# EAGLE design motor_front (EAGLE 7.7.0)
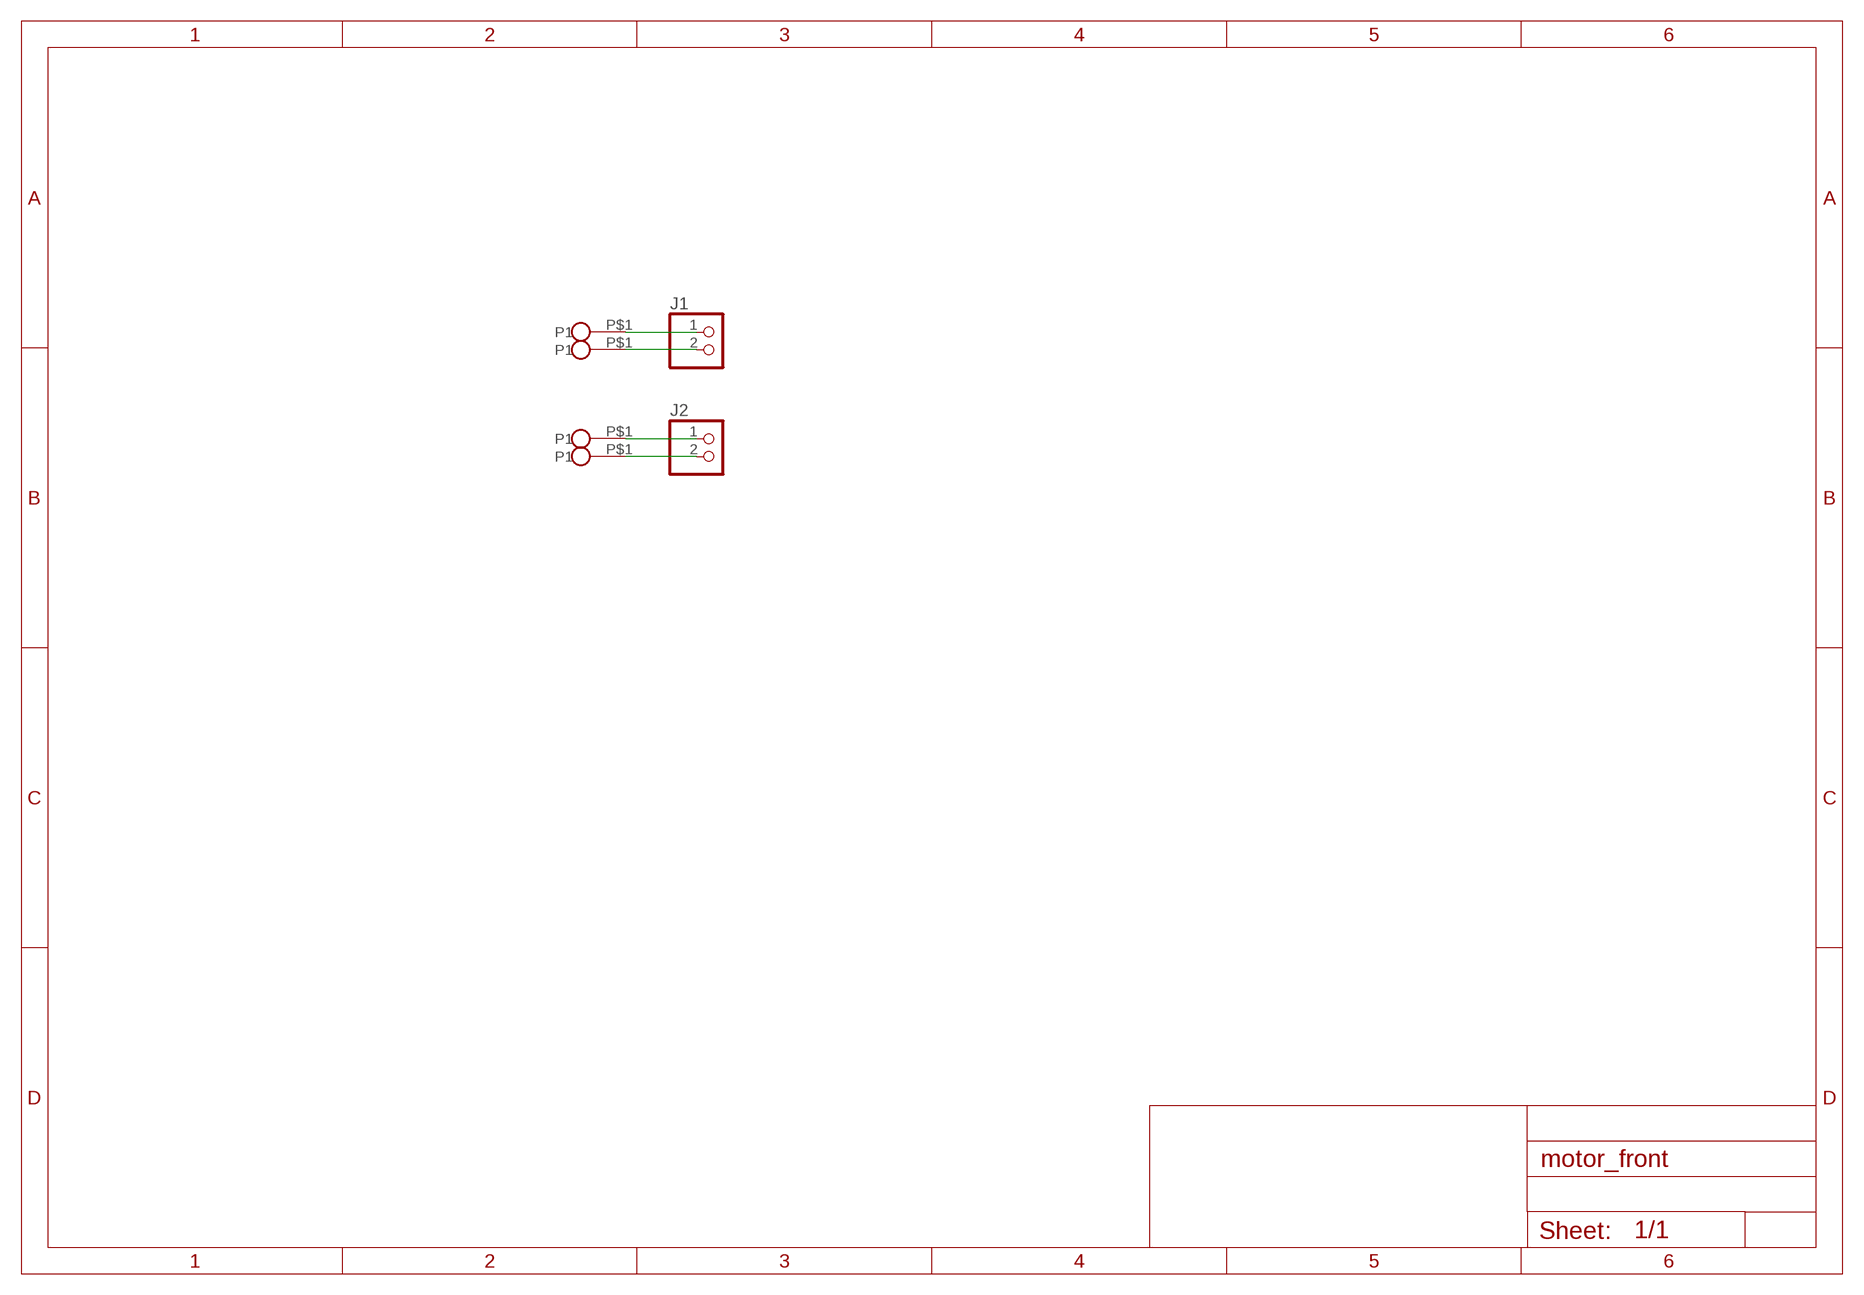
[diagram p0: schematic, sheet 1]

## Parts
J1  PINHD-1X2  [1X02]
J2  PINHD-1X2  [1X02]
U$1  BIGHOLE  [BIGHOLE]
U$2  BIGHOLE  [BIGHOLE]
U$3  BIGHOLE  [BIGHOLE]
U$4  BIGHOLE  [BIGHOLE]

## Nets
N$1: J1.1 U$1.P$1(P1)
N$2: J1.2 U$2.P$1(P1)
N$3: J2.1 U$4.P$1(P1)
N$4: J2.2 U$3.P$1(P1)

## Library data of the parts
J1 J2 = pinhead:PINHD-1X2: PIN HEADER
U$1-U$4 = testpoint:BIGHOLE

## Board
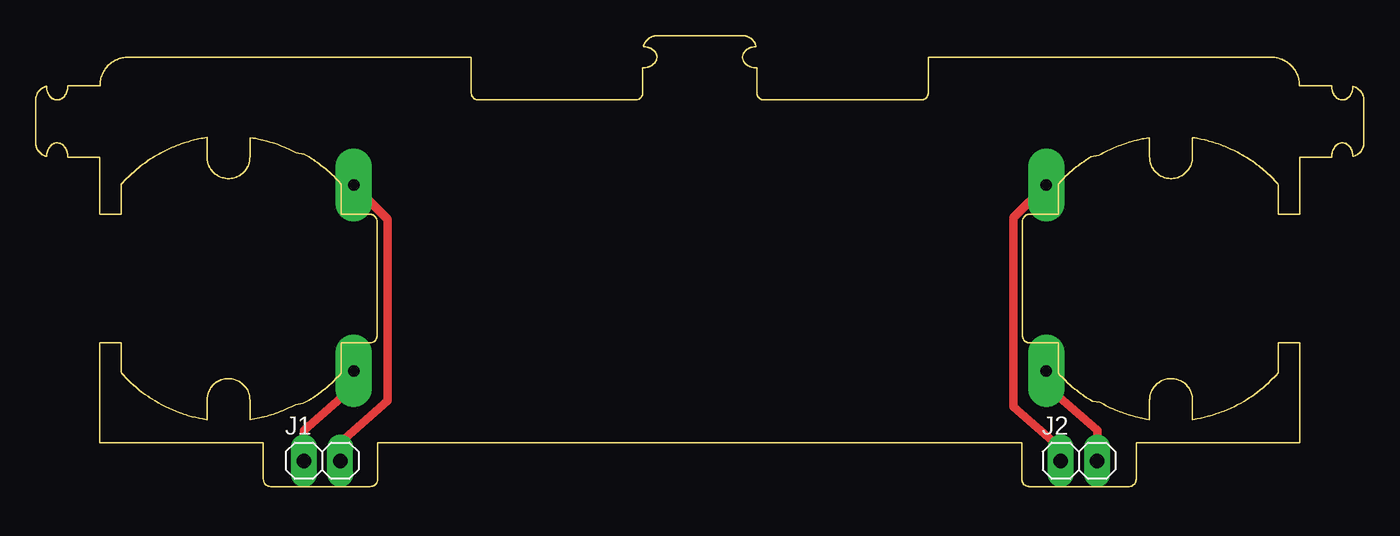
[diagram p1: board, top side]

Size 93 x 31.56 mm. Coordinates in mm from the lower left corner, seen from the top.
Outline: 43.5,31.56 43.45,31.55 43.39,31.55 43.34,31.54 43.29,31.53 43.24,31.52 43.19,31.5 43.14,31.49 43.09,31.47 43.04,31.44 43,31.41 42.95,31.39 42.91,31.36 42.87,31.32 42.83,31.29 42.79,31.25 42.76,31.21 42.73,31.17 42.69,31.12 42.67,31.08 42.64,31.03 42.62,30.99 42.6,30.94 42.58,30.89 42.56,30.84 42.56,30.8 42.67,30.79 42.72,30.78 42.82,30.76 42.87,30.75 42.92,30.73 42.97,30.71 43.02,30.69 43.07,30.67 43.12,30.64 43.16,30.61 43.21,30.58 43.25,30.55 43.29,30.52 43.32,30.48 43.36,30.44 43.39,30.4 43.42,30.35 43.44,30.3 43.46,30.26 43.48,30.21 43.49,30.15 43.5,30.1 43.5,30.05 43.5,30 43.49,29.94 43.48,29.89 43.46,29.84 43.44,29.79 43.41,29.75 43.38,29.7 43.35,29.66 43.32,29.62 43.28,29.59 43.24,29.55 43.2,29.52 43.15,29.49 43.11,29.46 43.06,29.43 43.01,29.41 42.97,29.39 42.92,29.37 42.87,29.36 42.81,29.34 42.71,29.32 42.61,29.31 42.5,29.31 42.5,27.56 42.5,27.51 42.49,27.45 42.48,27.4 42.46,27.35 42.43,27.31 42.41,27.26 42.37,27.22 42.33,27.18 42.29,27.15 42.25,27.12 42.2,27.1 42.15,27.08 42.1,27.07 42.05,27.06 42,27.06 31.04,27.06 30.99,27.06 30.94,27.06 30.88,27.07 30.83,27.09 30.78,27.11 30.74,27.13 30.69,27.16 30.65,27.19 30.62,27.23 30.59,27.27 30.56,27.32 30.54,27.37 30.52,27.42 30.51,27.47 30.5,27.52 30.5,27.57 30.5,30.01 30.49,30.06 6.52,30.06 6.42,30.05 6.36,30.05 6.26,30.04 6.15,30.03 6.05,30.01 6,29.99 5.9,29.96 5.8,29.93 5.7,29.89 5.65,29.87 5.56,29.82 5.46,29.77 5.42,29.74 5.33,29.68 5.25,29.62 5.21,29.58 5.13,29.51 5.05,29.44 4.98,29.36 4.91,29.28 4.88,29.24 4.82,29.15 4.77,29.06 4.72,28.97 4.69,28.92 4.65,28.82 4.61,28.72 4.6,28.67 4.57,28.57 4.54,28.47 4.52,28.36 4.52,28.31 4.51,28.21 4.5,28.1 4.49,28.06 2.27,28.06 2.25,28.02 2.24,27.92 2.23,27.81 2.22,27.76 2.2,27.71 2.19,27.66 2.17,27.61 2.15,27.56 2.13,27.51 2.11,27.46 2.08,27.42 2.05,27.37 2.02,27.33 1.98,27.29 1.95,27.25 1.91,27.22 1.87,27.18 1.82,27.15 1.78,27.13 1.73,27.1 1.68,27.09 1.63,27.07 1.58,27.06 1.53,27.06 1.47,27.06 1.42,27.06 1.37,27.07 1.32,27.09 1.27,27.11 1.22,27.13 1.17,27.16 1.13,27.19 1.09,27.22 1.05,27.26 1.02,27.3 0.98,27.34 0.95,27.38 0.92,27.42 0.9,27.47 0.87,27.52 0.85,27.57 0.83,27.61 0.82,27.66 0.8,27.71 0.79,27.77 0.77,27.87 0.76,27.98 0.74,28 0.69,27.99 0.64,27.97 0.59,27.95 0.54,27.93 0.49,27.9 0.45,27.87 0.4,27.84 0.36,27.81 0.32,27.78 0.28,27.74 0.25,27.7 0.21,27.66 0.18,27.62 0.15,27.57 0.12,27.53 0.1,27.48 0.08,27.43 0.06,27.39 0.04,27.34 0.03,27.28 0.02,27.23 0.01,27.18 0,27.13 0,27.02 0,24.06 0,24.01 0.01,23.95 0.01,23.9 0.02,23.85 0.03,23.8 0.05,23.75 0.07,23.7 0.09,23.65 0.11,23.6 0.14,23.55 0.17,23.51 0.2,23.47 0.23,23.43 0.27,23.39 0.31,23.35 0.35,23.32 0.39,23.28 0.43,23.25 0.47,23.22 0.52,23.2 0.57,23.17 0.62,23.15 0.67,23.13 0.72,23.12 0.76,23.12 0.77,23.22 0.78,23.33 0.8,23.38 0.81,23.43 0.83,23.48 0.84,23.53 0.86,23.58 0.89,23.62 0.91,23.67 0.94,23.72 0.97,23.76 1,23.8 1.04,23.84 1.08,23.88 1.12,23.91 1.16,23.95 1.2,23.97 1.25,24 1.3,24.02 1.35,24.04 1.4,24.05 1.45,24.05 1.5,24.06 1.56,24.05 1.61,24.05 1.66,24.03 1.71,24.02 1.76,24 1.81,23.97 1.85,23.94 1.89,23.91 1.93,23.87 1.97,23.84 2.01,23.8 2.04,23.75 2.07,23.71 2.1,23.67 2.12,23.62 2.14,23.57 2.16,23.52 2.18,23.47 2.2,23.42 2.21,23.37 2.23,23.27 2.25,23.16 2.25,23.06 2.3,23.06 4.47,23.06 4.5,23.03 4.5,19.06 4.55,19.06 5.97,19.06 6,19.08 6,21.15 6.02,21.19 6.13,21.31 6.24,21.42 6.35,21.54 6.5,21.69 6.61,21.8 6.73,21.91 6.85,22.01 6.97,22.12 7.09,22.22 7.21,22.32 7.33,22.42 7.5,22.55 7.63,22.64 7.76,22.74 7.89,22.83 8.07,22.94 8.2,23.03 8.34,23.11 8.47,23.19 8.61,23.27 8.8,23.37 8.94,23.45 9.13,23.54 9.27,23.61 9.41,23.68 9.56,23.74 9.7,23.8 9.9,23.88 10.05,23.93 10.2,23.99 10.4,24.06 10.55,24.1 10.7,24.15 10.86,24.19 11.11,24.26 11.27,24.3 11.42,24.33 11.58,24.36 11.73,24.39 11.99,24.43 12,24.39 12,23.01 12,22.96 12.01,22.86 12.03,22.75 12.06,22.65 12.09,22.55 12.13,22.45 12.17,22.35 12.23,22.26 12.25,22.22 12.32,22.13 12.39,22.05 12.42,22.01 12.5,21.94 12.58,21.87 12.66,21.81 12.71,21.78 12.8,21.73 12.9,21.68 12.95,21.66 13.04,21.63 13.15,21.6 13.25,21.58 13.3,21.57 13.41,21.56 13.46,21.56 13.57,21.56 13.67,21.57 13.78,21.58 13.83,21.59 13.93,21.62 14.03,21.65 14.08,21.67 14.18,21.72 14.27,21.77 14.31,21.8 14.4,21.86 14.44,21.89 14.52,21.96 14.56,21.99 14.6,22.03 14.67,22.11 14.73,22.2 14.76,22.24 14.79,22.29 14.84,22.38 14.86,22.43 14.9,22.52 14.94,22.62 14.95,22.68 14.97,22.78 14.99,22.88 15,22.99 15,23.09 15,24.42 15.03,24.43 15.24,24.4 15.4,24.37 15.61,24.32 15.76,24.29 15.92,24.25 16.07,24.21 16.22,24.17 16.42,24.11 16.58,24.06 16.73,24.01 16.93,23.94 17.08,23.89 17.22,23.83 17.42,23.75 17.56,23.68 17.76,23.6 17.9,23.53 18.09,23.43 18.23,23.36 18.81,23.26 19,23.15 19.13,23.07 19.31,22.96 19.45,22.87 19.58,22.78 19.71,22.69 19.84,22.6 20,22.47 20.17,22.34 20.29,22.24 20.41,22.13 20.57,22 20.77,21.82 20.88,21.71 21,21.59 21.11,21.48 21.22,21.36 21.39,21.17 21.4,21.12 21.4,19.11 21.4,19.06 23.36,19.06 23.41,19.06 23.46,19.05 23.52,19.04 23.57,19.03 23.62,19.01 23.66,18.98 23.71,18.95 23.75,18.92 23.78,18.88 23.81,18.84 23.84,18.79 23.86,18.74 23.88,18.69 23.89,18.64 23.9,18.59 23.9,18.54 23.9,10.55 23.9,10.49 23.89,10.44 23.87,10.39 23.85,10.34 23.83,10.29 23.8,10.25 23.76,10.21 23.72,10.18 23.68,10.14 23.64,10.12 23.59,10.09 23.54,10.08 23.49,10.06 23.43,10.06 23.38,10.06 21.42,10.06 21.4,10.03 21.4,7.96 21.37,7.92 21.23,7.76 21.05,7.57 20.86,7.39 20.71,7.24 20.55,7.1 20.39,6.96 20.23,6.82 20.06,6.69 19.94,6.59 19.81,6.5 19.68,6.41 19.55,6.32 19.42,6.23 19.29,6.14 19.15,6.05 19.02,5.97 18.88,5.89 18.74,5.82 18.2,5.74 18.06,5.67 17.92,5.59 17.73,5.5 17.59,5.44 17.44,5.37 17.29,5.31 17.15,5.25 16.95,5.18 16.8,5.12 16.65,5.07 16.5,5.02 16.35,4.98 16.19,4.93 15.99,4.88 15.83,4.84 15.68,4.8 15.52,4.77 15.32,4.73 15.16,4.7 15,4.68 15,4.73 15,6.05 15,6.15 14.99,6.26 14.97,6.36 14.94,6.47 14.91,6.57 14.89,6.62 14.87,6.67 14.83,6.76 14.77,6.85 14.74,6.9 14.68,6.98 14.61,7.06 14.54,7.14 14.5,7.17 14.42,7.24 14.33,7.3 14.24,7.36 14.15,7.41 14.05,7.45 13.95,7.49 13.85,7.51 13.75,7.54 13.64,7.55 13.59,7.55 13.48,7.56 13.38,7.55 13.33,7.55 13.22,7.53 13.12,7.51 13.02,7.48 12.97,7.46 12.87,7.42 12.82,7.39 12.73,7.34 12.68,7.32 12.6,7.26 12.51,7.19 12.48,7.15 12.4,7.08 12.33,7 12.27,6.91 12.21,6.83 12.18,6.78 12.14,6.68 12.12,6.64 12.08,6.54 12.06,6.49 12.04,6.38 12.03,6.33 12.01,6.23 12,6.12 12,6.02 12,4.69 11.96,4.68 11.7,4.73 11.44,4.78 11.19,4.83 10.93,4.9 10.67,4.97 10.52,5.02 10.37,5.07 10.22,5.12 10.07,5.17 9.82,5.26 9.58,5.36 9.34,5.47 9.1,5.58 8.96,5.66 8.82,5.73 8.58,5.86 8.36,5.99 8.13,6.13 8,6.21 7.87,6.3 7.65,6.46 7.44,6.61 7.23,6.78 7.02,6.95 6.82,7.12 6.67,7.26 6.52,7.41 6.33,7.59 6.15,7.79 6.01,7.95 6,8 6,10.01 6,10.06 4.52,10.06 4.5,10.02 4.5,3.09 4.52,3.06 15.9,3.06 15.94,3.05 15.94,0.51 15.95,0.46 15.95,0.4 15.97,0.35 15.98,0.3 16.01,0.25 16.04,0.21 16.07,0.17 16.11,0.13 16.15,0.1 16.19,0.07 16.24,0.04 16.29,0.03 16.34,0.01 16.39,0 16.44,0 23.43,0 23.48,0 23.53,0.01 23.59,0.02 23.64,0.04 23.68,0.06 23.73,0.09 23.77,0.12 23.81,0.16 23.84,0.2 23.87,0.24 23.9,0.29 23.92,0.34 23.93,0.39 23.94,0.44 23.94,0.49 23.94,3.04 23.97,3.06 69.06,3.06 69.06,0.52 69.06,0.46 69.07,0.41 69.08,0.36 69.1,0.31 69.12,0.26 69.15,0.22 69.18,0.17 69.21,0.14 69.25,0.1 69.3,0.07 69.34,0.05 69.39,0.03 69.44,0.01 69.5,0 69.55,0 76.53,0 76.59,0 76.64,0.01 76.69,0.02 76.74,0.04 76.79,0.06 76.83,0.08 76.88,0.12 76.92,0.15 76.95,0.19 76.98,0.23 77.01,0.28 77.03,0.33 77.04,0.38 77.05,0.43 77.06,0.49 77.06,0.54 77.06,3.03 77.08,3.06 88.46,3.06 88.5,3.06 88.5,10.05 88.45,10.06 87.02,10.06 87,10.03 87,7.96 86.97,7.92 86.87,7.8 86.76,7.69 86.57,7.5 86.46,7.39 86.35,7.28 86.15,7.1 85.95,6.93 85.75,6.76 85.54,6.6 85.32,6.44 85.11,6.29 84.97,6.2 84.84,6.12 84.62,5.98 84.39,5.84 84.15,5.72 83.92,5.6 83.68,5.49 83.44,5.38 83.19,5.28 83.04,5.22 82.9,5.16 82.65,5.08 82.39,5 82.24,4.95 82.09,4.91 81.83,4.85 81.57,4.79 81.31,4.74 81.16,4.71 81,4.68 81,6.06 81,6.17 80.99,6.22 80.98,6.32 80.95,6.43 80.93,6.53 80.89,6.63 80.84,6.72 80.82,6.77 80.77,6.86 80.71,6.95 80.64,7.03 80.57,7.11 80.53,7.15 80.45,7.22 80.37,7.28 80.28,7.34 80.19,7.39 80.14,7.41 80.04,7.46 79.99,7.47 79.89,7.5 79.84,7.52 79.74,7.54 79.63,7.55 79.53,7.56 79.42,7.55 79.37,7.55 79.26,7.54 79.21,7.53 79.11,7.5 79.01,7.47 78.91,7.43 78.81,7.39 78.72,7.34 78.63,7.28 78.55,7.22 78.47,7.15 78.39,7.07 78.32,6.99 78.29,6.95 78.23,6.86 78.18,6.77 78.15,6.72 78.13,6.67 78.09,6.58 78.06,6.48 78.03,6.37 78.02,6.32 78.01,6.22 78,6.11 78,6.06 78,4.74 78,4.68 77.79,4.72 77.63,4.75 77.48,4.78 77.32,4.81 77.17,4.85 77.01,4.88 76.81,4.94 76.66,4.98 76.5,5.03 76.35,5.08 76.2,5.13 76.05,5.18 75.9,5.24 75.76,5.3 75.56,5.38 75.42,5.44 75.22,5.53 75.08,5.6 74.94,5.67 74.8,5.74 74.66,5.82 74.52,5.9 73.98,5.98 73.85,6.06 73.71,6.14 73.58,6.23 73.45,6.32 73.32,6.41 73.19,6.5 73.02,6.63 72.89,6.73 72.77,6.83 72.61,6.96 72.45,7.1 72.25,7.28 72.1,7.42 71.91,7.61 71.73,7.8 71.63,7.92 71.6,7.97 71.6,10.03 71.57,10.06 69.62,10.06 69.56,10.06 69.51,10.06 69.46,10.08 69.41,10.09 69.36,10.12 69.32,10.14 69.27,10.18 69.24,10.21 69.2,10.25 69.17,10.3 69.15,10.34 69.13,10.39 69.11,10.44 69.1,10.5 69.1,10.55 69.1,18.54 69.1,18.59 69.11,18.64 69.12,18.7 69.14,18.75 69.16,18.79 69.19,18.84 69.22,18.88 69.26,18.92 69.3,18.95 69.34,18.98 69.39,19.01 69.43,19.03 69.49,19.04 69.54,19.05 69.59,19.06 71.6,19.06 71.6,21.12 71.61,21.17 71.79,21.37 71.9,21.48 72.01,21.59 72.12,21.71 72.23,21.82 72.43,22 72.55,22.1 72.71,22.24 72.87,22.37 73,22.47 73.13,22.56 73.25,22.66 73.38,22.75 73.56,22.87 73.69,22.95 73.87,23.07 74.45,23.18 74.59,23.25 74.78,23.36 74.92,23.43 75.06,23.5 75.2,23.57 75.34,23.64 75.49,23.7 75.68,23.79 75.83,23.84 75.98,23.9 76.18,23.98 76.38,24.04 76.53,24.09 76.68,24.14 76.89,24.19 77.09,24.25 77.25,24.28 77.45,24.33 77.61,24.36 77.76,24.39 77.97,24.42 78,24.4 78,23.08 78,22.97 78.01,22.87 78.03,22.76 78.05,22.66 78.07,22.61 78.08,22.56 78.12,22.46 78.17,22.37 78.19,22.32 78.25,22.23 78.28,22.18 78.34,22.1 78.41,22.02 78.45,21.98 78.53,21.91 78.57,21.88 78.61,21.85 78.7,21.79 78.79,21.73 78.84,21.71 78.93,21.67 79.03,21.63 79.08,21.61 79.19,21.59 79.29,21.57 79.34,21.57 79.45,21.56 79.55,21.56 79.66,21.57 79.71,21.57 79.82,21.59 79.92,21.61 79.97,21.63 80.07,21.67 80.16,21.71 80.26,21.76 80.35,21.82 80.43,21.88 80.47,21.91 80.55,21.98 80.62,22.06 80.66,22.1 80.72,22.18 80.78,22.27 80.83,22.37 80.88,22.46 80.92,22.56 80.93,22.61 80.96,22.71 80.98,22.82 80.99,22.92 81,23.03 81,24.4 81.03,24.43 81.18,24.4 81.34,24.37 81.6,24.32 81.86,24.26 82.01,24.22 82.16,24.18 82.32,24.14 82.47,24.09 82.62,24.05 82.82,23.98 82.97,23.92 83.12,23.87 83.27,23.81 83.41,23.75 83.56,23.68 83.7,23.62 83.89,23.53 84.04,23.46 84.18,23.39 84.32,23.31 84.46,23.23 84.64,23.13 84.78,23.04 84.95,22.93 85.09,22.84 85.22,22.75 85.39,22.63 85.52,22.54 85.64,22.44 85.77,22.34 85.89,22.24 86.01,22.14 86.13,22.04 86.29,21.89 86.41,21.79 86.52,21.68 86.63,21.56 86.78,21.41 86.89,21.3 86.99,21.18 87,21.13 87,19.06 87.05,19.06 88.48,19.06 88.5,19.08 88.5,23.05 88.55,23.06 90.72,23.06 90.75,23.08 90.76,23.18 90.77,23.29 90.78,23.34 90.79,23.39 90.81,23.44 90.82,23.49 90.84,23.54 90.87,23.59 90.89,23.64 90.92,23.68 90.94,23.73 90.97,23.77 91.01,23.81 91.04,23.85 91.08,23.89 91.12,23.92 91.17,23.95 91.21,23.98 91.26,24 91.31,24.02 91.36,24.04 91.41,24.05 91.46,24.05 91.52,24.06 91.57,24.05 91.62,24.04 91.67,24.03 91.72,24.01 91.77,23.99 91.82,23.96 91.86,23.93 91.9,23.9 91.94,23.86 91.98,23.83 92.01,23.79 92.04,23.74 92.07,23.7 92.1,23.65 92.12,23.61 92.14,23.56 92.16,23.51 92.18,23.46 92.2,23.41 92.21,23.36 92.23,23.25 92.24,23.15 92.25,23.11 92.3,23.12 92.35,23.14 92.4,23.16 92.45,23.18 92.5,23.21 92.54,23.23 92.59,23.26 92.63,23.3 92.67,23.33 92.71,23.36 92.75,23.4 92.78,23.44 92.81,23.48 92.84,23.53 92.87,23.57 92.9,23.62 92.92,23.67 92.94,23.72 92.96,23.77 92.97,23.82 92.98,23.87 92.99,23.92 93,23.97 93,24.03 93,27.04 93,27.09 93,27.15 92.99,27.2 92.98,27.25 92.97,27.3 92.95,27.36 92.94,27.41 92.92,27.45 92.89,27.5 92.87,27.55 92.84,27.59 92.81,27.64 92.77,27.68 92.74,27.72 92.7,27.75 92.66,27.79 92.62,27.82 92.58,27.85 92.54,27.88 92.49,27.91 92.44,27.93 92.39,27.96 92.35,27.98 92.3,27.99 92.24,28.01 92.24,27.9 92.22,27.8 92.21,27.75 92.19,27.7 92.18,27.64 92.16,27.59 92.14,27.55 92.12,27.5 92.09,27.45 92.07,27.41 92.04,27.36 92,27.32 91.97,27.28 91.93,27.24 91.89,27.21 91.85,27.17 91.81,27.14 91.76,27.12 91.71,27.1 91.66,27.08 91.61,27.07 91.56,27.06 91.51,27.06 91.45,27.06 91.4,27.07 91.35,27.08 91.3,27.09 91.25,27.11 91.2,27.14 91.16,27.16 91.12,27.2 91.08,27.23 91.04,27.27 91,27.31 90.97,27.35 90.94,27.39 90.91,27.44 90.89,27.48 90.86,27.53 90.84,27.58 90.82,27.63 90.81,27.68 90.79,27.73 90.77,27.83 90.76,27.94 90.75,28.04 90.71,28.06 88.54,28.06 88.5,28.07 88.5,28.17 88.49,28.28 88.47,28.38 88.46,28.44 88.44,28.54 88.41,28.64 88.38,28.74 88.36,28.79 88.32,28.89 88.27,28.98 88.25,29.03 88.19,29.12 88.14,29.21 88.11,29.25 88.04,29.34 87.97,29.41 87.93,29.45 87.86,29.53 87.78,29.6 87.69,29.66 87.61,29.72 87.52,29.78 87.43,29.83 87.38,29.86 87.28,29.9 87.23,29.92 87.13,29.95 87.03,29.98 86.93,30.01 86.88,30.02 86.77,30.04 86.67,30.05 86.56,30.05 86.46,30.06 62.54,30.06 62.5,30.04 62.5,27.55 62.5,27.5 62.49,27.45 62.47,27.4 62.46,27.35 62.43,27.3 62.4,27.26 62.37,27.22 62.33,27.18 62.29,27.15 62.24,27.12 62.2,27.1 62.15,27.08 62.1,27.07 62.04,27.06 61.99,27.06 50.98,27.06 50.93,27.06 50.88,27.07 50.83,27.09 50.78,27.11 50.73,27.13 50.69,27.16 50.65,27.2 50.62,27.24 50.58,27.28 50.56,27.32 50.53,27.37 50.52,27.42 50.51,27.47 50.5,27.53 50.5,27.58 50.5,29.27 50.48,29.31 50.37,29.31 50.27,29.33 50.17,29.35 50.12,29.36 50.07,29.38 50.02,29.4 49.97,29.42 49.92,29.44 49.87,29.47 49.83,29.5 49.79,29.53 49.75,29.56 49.71,29.6 49.67,29.64 49.64,29.68 49.6,29.72 49.58,29.77 49.55,29.81 49.53,29.86 49.52,29.91 49.51,29.96 49.5,30.02 49.5,30.07 49.5,30.12 49.51,30.17 49.53,30.23 49.54,30.27 49.57,30.32 49.59,30.37 49.62,30.41 49.65,30.45 49.69,30.49 49.73,30.53 49.77,30.56 49.81,30.6 49.85,30.62 49.9,30.65 49.95,30.68 50,30.7 50.04,30.72 50.09,30.74 50.14,30.75 50.2,30.77 50.3,30.79 50.41,30.8 50.45,30.81 50.43,30.86 50.42,30.91 50.4,30.96 50.38,31 50.35,31.05 50.32,31.1 50.29,31.14 50.26,31.18 50.23,31.22 50.19,31.26 50.16,31.3 50.12,31.34 50.07,31.37 50.03,31.4 49.99,31.43 49.94,31.45 49.89,31.47 49.84,31.49 49.79,31.51 49.74,31.53 49.69,31.54 49.64,31.55 49.59,31.55 49.53,31.56 43.5,31.56
Copper layers (1*16): Top 0.035mm / dielectric 1.6mm / Bottom 0.035mm
Design rules "jlcpcb-2layers *": minimum track width 5mil, minimum drill 0.3mm, track to track 5mil, track to pad 5mil, pad to pad 5mil, via to via 5mil, smd to smd 5mil, copper to edge 0.2mm, drill to drill 6mil, minimum pad ring 10mil, minimum via ring 3mil, stop-mask expansion 4mil, vias tented up to drill 25mil, thermal gap 10mil

### Footprints (pad centres in the part's own frame; a part is rotated, then mirrored left to right if it is on the bottom)
1X02 = drill 1.016 long: 1 -1.27,0; 2 1.27,0
BIGHOLE = drill 0.8 pad 2.54 long: P$1 0,0

### Placement (x,y rotation side)
J1  20.06,1.8 0 top
J2  73.06,1.8 0 top
U$1  22.27,8.1 90 top
U$2  22.27,21.1 90 top
U$3  70.76,8.1 90 top
U$4  70.76,21.1 90 top

### Tracks (layer width: path | path; a pad name or v marks a point on that pad's centre or on a via)
N$1
  Top 0.61: J1.1 18.79,3.93 22.26,7 U$1.P$1
N$2
  Top 0.61: J1.2 21.33,3.07 24.66,6 24.66,18.71 U$2.P$1
N$3
  Top 0.61: J2.1 71.79,2.67 68.46,5.6 68.46,18.8 U$4.P$1
N$4
  Top 0.61: J2.2 74.33,3.93 70.86,7 70.86,8 U$3.P$1